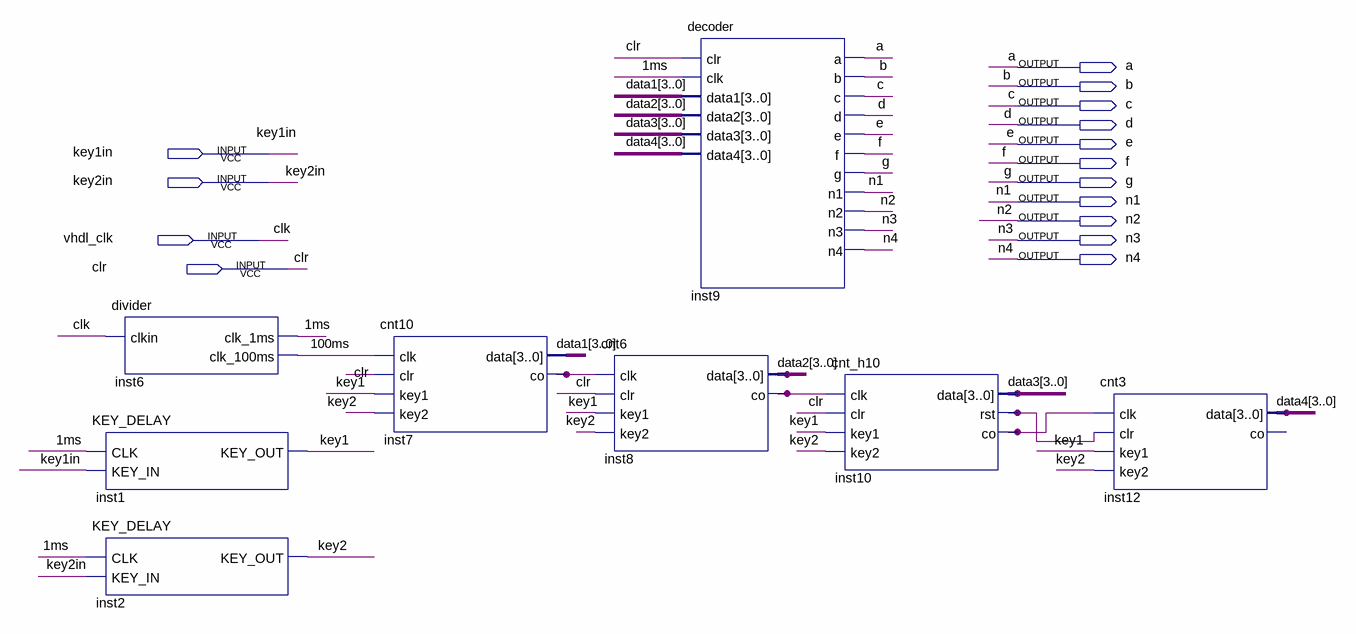
[diagram p0: schematic sheet]
// Quartus schematic clock1.bdf as structural Verilog: 8 symbols, 15 pins
module clock1 (
  input  key1in,
  input  key2in,
  input  vhdl_clk,
  input  clr,
  output a,
  output b,
  output c,
  output d,
  output e,
  output f,
  output g,
  output n1,
  output n2,
  output n3,
  output n4
);

  wire \1ms , \100ms , inst7_co, inst8_co, inst10_co, inst10_rst, key1, key2;
  wire [3:0] data1, data2, data3, data4;

  divider inst6 (.clkin(vhdl_clk), .clk_1ms(\1ms ), .clk_100ms(\100ms ));
  KEY_DELAY inst1 (.CLK(\1ms ), .KEY_IN(key1in), .KEY_OUT(key1));
  KEY_DELAY inst2 (.CLK(\1ms ), .KEY_IN(key2in), .KEY_OUT(key2));
  cnt10 inst7 (.clk(\100ms ), .clr(clr), .key1(key1), .key2(key2), .data(data1), .co(inst7_co));
  cnt6 inst8 (.clk(inst7_co), .clr(clr), .key1(key1), .key2(key2), .data(data2), .co(inst8_co));
  decoder inst9 (
    .clr(clr), .clk(\1ms ), .data1(data1), .data2(data2), .data3(data3), .data4(data4), .a(a), .b(b), .c(c),
    .d(d), .e(e), .f(f), .g(g), .n1(n1), .n2(n2), .n3(n3), .n4(n4));
  cnt_h10 inst10 (.clk(inst8_co), .clr(clr), .key1(key1), .key2(key2), .data(data3), .rst(inst10_rst), .co(inst10_co));
  cnt3 inst12 (.clk(inst10_co), .clr(inst10_rst), .key1(key1), .key2(key2), .data(data4));  // open: co

  // Other names for the same wires on the sheet: clk = vhdl_clk
endmodule
